# EAGLE design Blank board for UFP (EAGLE 6.5.0)
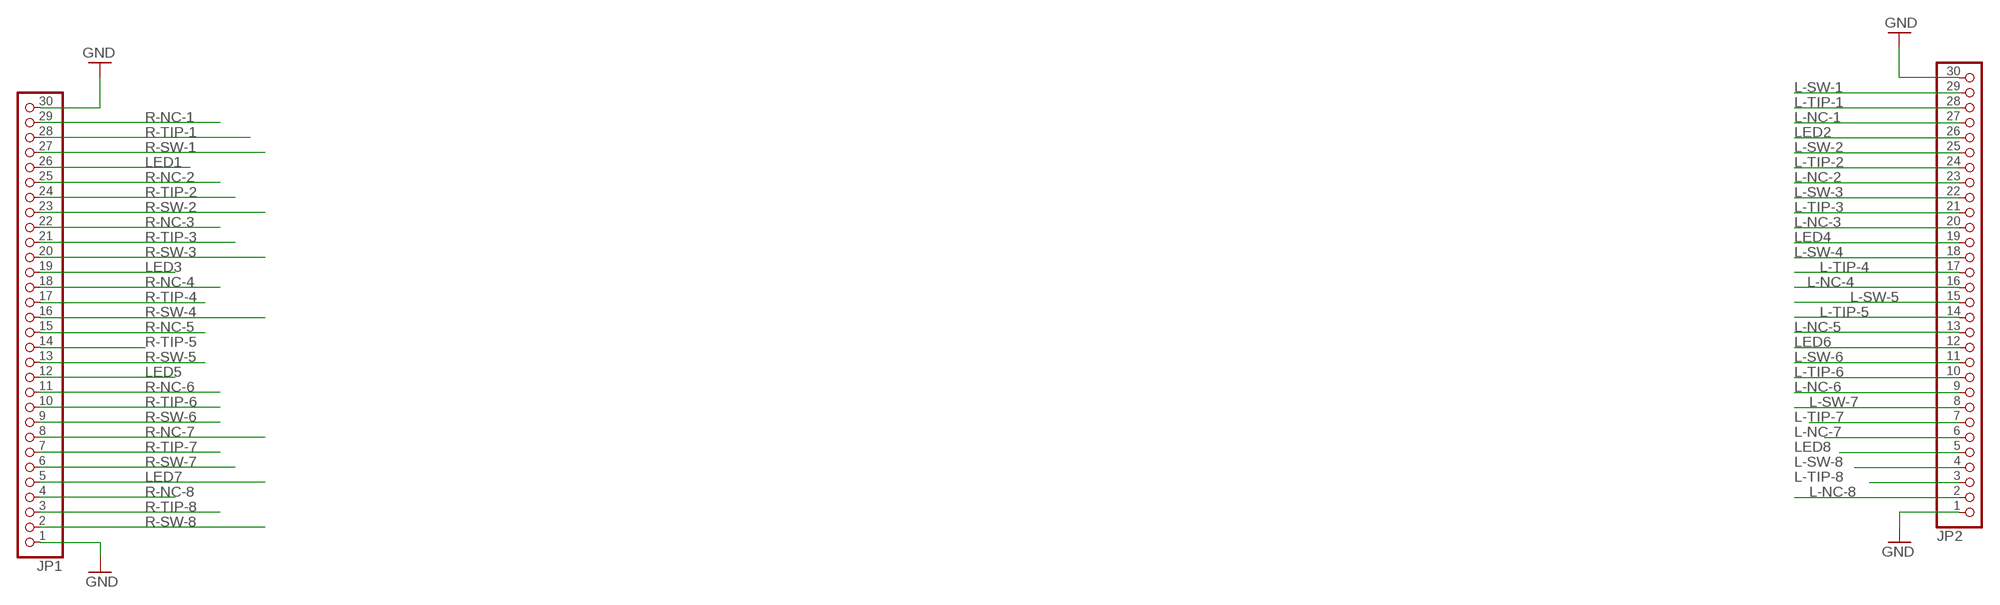
[diagram p0: schematic, sheet 1]

## Parts
JP1  PINHD-1X30  [1X30]
JP2  PINHD-1X30  [1X30]

## Nets
GND: JP1.1 JP1.30 JP2.1 JP2.30
L-NC-1: JP2.27
L-NC-2: JP2.23
L-NC-3: JP2.20
L-NC-4: JP2.16
L-NC-5: JP2.13
L-NC-6: JP2.9
L-NC-7: JP2.6
L-NC-8: JP2.2
L-SW-1: JP2.29
L-SW-2: JP2.25
L-SW-3: JP2.22
L-SW-4: JP2.18
L-SW-5: JP2.15
L-SW-6: JP2.11
L-SW-7: JP2.8
L-SW-8: JP2.4
L-TIP-1: JP2.28
L-TIP-2: JP2.24
L-TIP-3: JP2.21
L-TIP-4: JP2.17
L-TIP-5: JP2.14
L-TIP-6: JP2.10
L-TIP-7: JP2.7
L-TIP-8: JP2.3
LED1: JP1.26
LED2: JP2.26
LED3: JP1.19
LED4: JP2.19
LED5: JP1.12
LED6: JP2.12
LED7: JP1.5
LED8: JP2.5
R-NC-1: JP1.29
R-NC-2: JP1.25
R-NC-3: JP1.22
R-NC-4: JP1.18
R-NC-5: JP1.15
R-NC-6: JP1.11
R-NC-7: JP1.8
R-NC-8: JP1.4
R-SW-1: JP1.27
R-SW-2: JP1.23
R-SW-3: JP1.20
R-SW-4: JP1.16
R-SW-5: JP1.13
R-SW-6: JP1.9
R-SW-7: JP1.6
R-SW-8: JP1.2
R-TIP-1: JP1.28
R-TIP-2: JP1.24
R-TIP-3: JP1.21
R-TIP-4: JP1.17
R-TIP-5: JP1.14
R-TIP-6: JP1.10
R-TIP-7: JP1.7
R-TIP-8: JP1.3

## Library data of the parts
JP1 JP2 = pinhead:PINHD-1X30: PIN HEADER

## Board
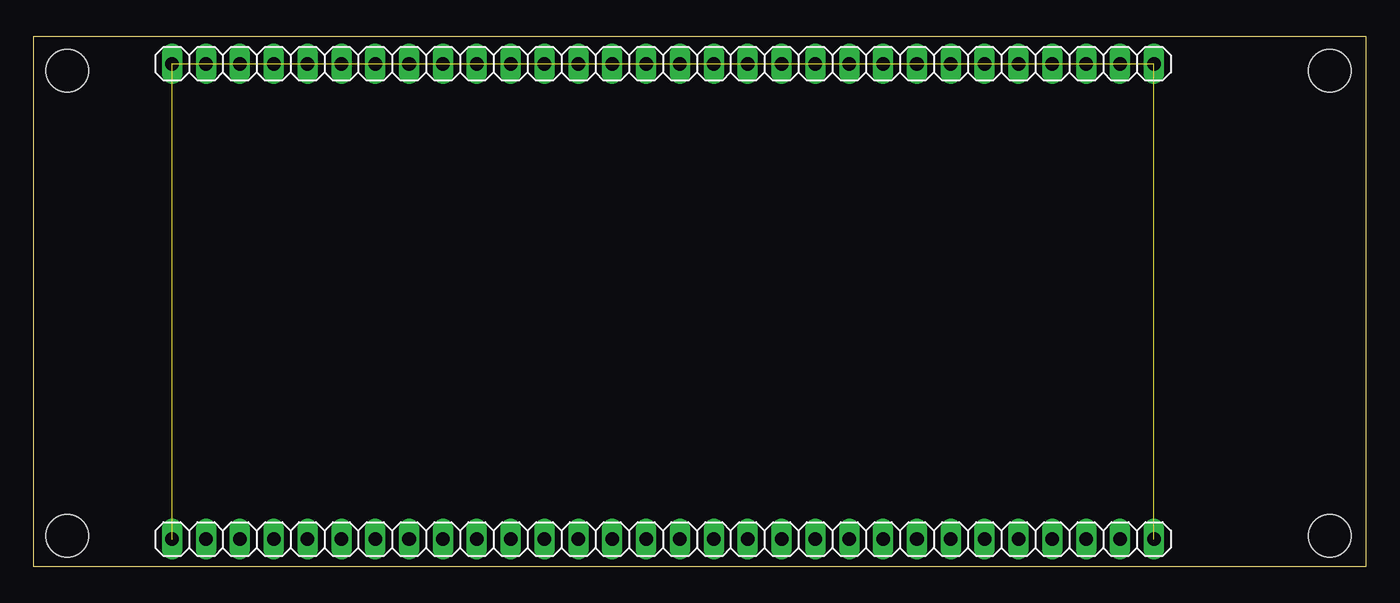
[diagram p1: board, top side]
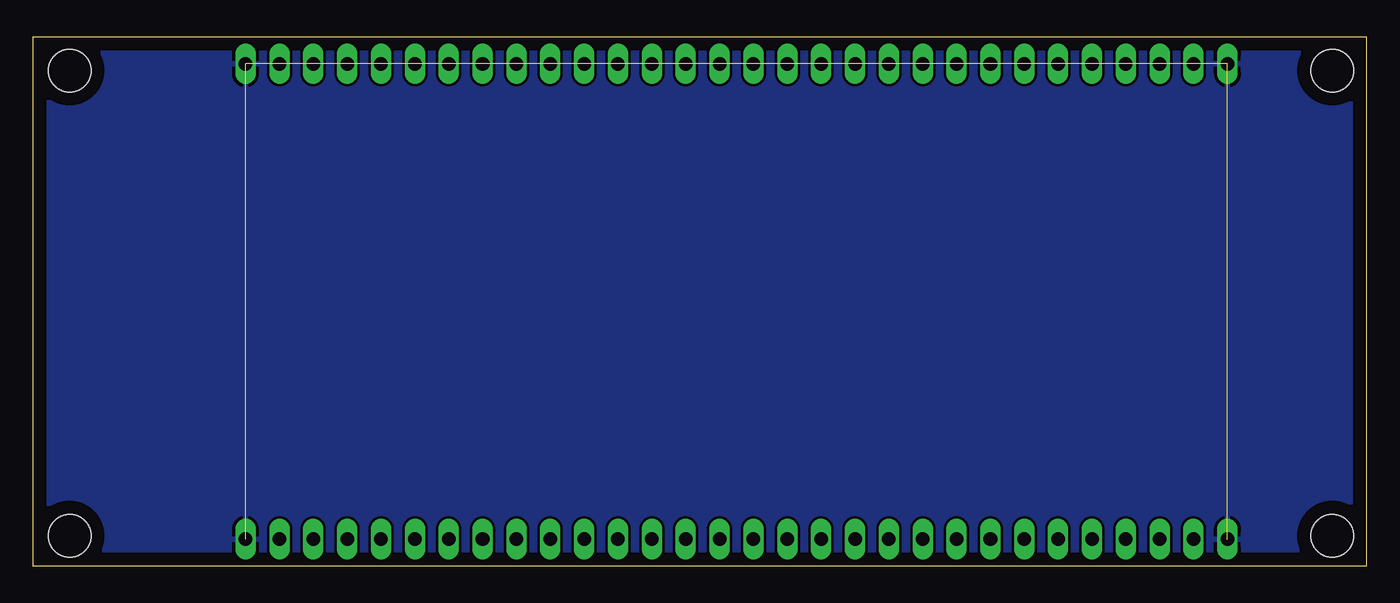
[diagram p2: board, bottom side, seen from below]

Size 100 x 39.75 mm. Coordinates in mm from the lower left corner, seen from the top.
Outline: 0,0 100,0 100,39.75 0,39.75 0,0
Copper layers (1*16): Top 0.035mm / dielectric 1.5mm / Bottom 0.035mm
Design rules "default *": minimum track width 10mil, minimum drill 24mil, track to track 8mil, track to pad 8mil, pad to pad 8mil, via to via 8mil, smd to smd 8mil, copper to edge 40mil, drill to drill 10mil, minimum pad ring 0mil, minimum via ring 0mil, stop-mask expansion 4mil, vias tented up to drill 20mil, thermal gap 10mil
Holes 3.2 mm at 2.54,37.21 2.54,2.29 97.28,2.29 97.28,37.21

### Footprints (pad centres in the part's own frame; a part is rotated, then mirrored left to right if it is on the bottom)
1X30 = drill 1.016 long: 1 -36.83,0; 2 -34.29,0; 3 -31.75,0; 4 -29.21,0; 5 -26.67,0; 6 -24.13,0; 7 -21.59,0; 8 -19.05,0; 9 -16.51,0; 10 -13.97,0; 11 -11.43,0; 12 -8.89,0; 13 -6.35,0; 14 -3.81,0; 15 -1.27,0; 16 1.27,0; 17 3.81,0; 18 6.35,0; 19 8.89,0; 20 11.43,0; 21 13.97,0; 22 16.51,0; 23 19.05,0; 24 21.59,0; 25 24.13,0; 26 26.67,0; 27 29.21,0; 28 31.75,0; 29 34.29,0; 30 36.83,0

### Placement (x,y rotation side)
JP1  47.24,2.03 0 top
JP2  47.24,37.72 0 top

### Tracks (layer width: path | path; a pad name or v marks a point on that pad's centre or on a via)
GND  (3 unrouted)
  pour Bottom: 101.6,-2.79 -2.54,-2.79 -2.29,42.16 101.6,42.93